# Altium project e80_doppler.PrjPcb
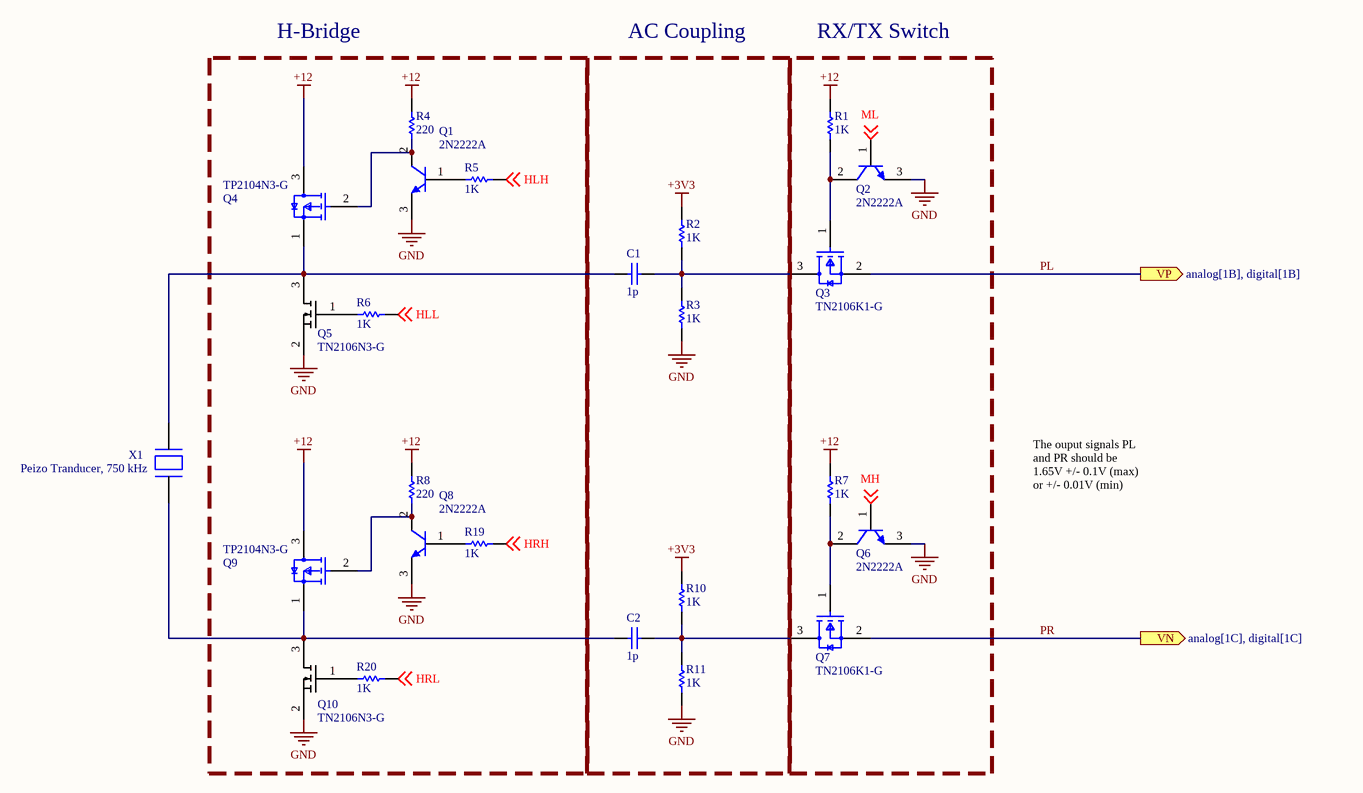
[diagram p0: interface.SchDoc]
4 sheets, 102 parts. Net scope: flat (ports and power ports of the same name join across sheets).
Sheets:
  interface.SchDoc
  analog.SchDoc
  digital.SchDoc
  simulation.SchDoc

## Sheet interface.SchDoc
size 381 x 241 mm; SheetNumber: 1; SheetTotal: 4

### Parts
C1  value 1p  (hidden comment: Capacitor)
C2  value 1p  (hidden comment: Capacitor)
Q1  2N2222A  [STM-TO-18-3]
Q2  2N2222A  [STM-TO-18-3]
Q3  TN2106K1-G  [FP-K1-T-IPC_A]
Q4  TP2104N3-G  [FP-TP2104N3-G-MFG]
Q5  TN2106N3-G
Q6  2N2222A  [STM-TO-18-3]
Q7  TN2106K1-G  [FP-K1-T-IPC_A]
Q8  2N2222A  [STM-TO-18-3]
Q9  TP2104N3-G  [FP-TP2104N3-G-MFG]
Q10  TN2106N3-G
R1  value 1K  (hidden comment: Resistor)
R2  value 1K  (hidden comment: Resistor)
R3  value 1K  (hidden comment: Resistor)
R4  value 220  (hidden comment: Resistor)
R5  value 1K  (hidden comment: Resistor)
R6  value 1K  (hidden comment: Resistor)
R7  value 1K  (hidden comment: Resistor)
R8  value 220  (hidden comment: Resistor)
R10  value 1K  (hidden comment: Resistor)
R11  value 1K  (hidden comment: Resistor)
R19  value 1K  (hidden comment: Resistor)
R20  value 1K  (hidden comment: Resistor)
X1  Peizo Tranducer, 750 kHz

### Blocks framed on the sheet
H-Bridge: Q1 Q4 Q5 Q8-Q10 R4-R6 R8 R19 R20
AC Coupling: C1 C2 R2 R3 R10 R11
RX/TX Switch: Q2 Q3 Q6 Q7 R1 R7

### Ports
VN (out, see analog[1C], digital[1C]), VP (out, see analog[1B], digital[1B])

### Nets
+3V3: R2.2 R10.2
+12: Q4.3(Drain) Q9.3(Drain) R1.2 R4.2 R7.2 R8.2
GND: Q1.3(E) Q2.3(E) Q5.2(S) Q6.3(E) Q8.3(E) Q10.2(S) R3.1 R11.1
HLH: R5.1 ; off-sheet HLH
HLL: R6.1 ; off-sheet HLL
HRH: R19.1 ; off-sheet HRH
HRL: R20.1 ; off-sheet HRL
MH: Q6.1(B) ; off-sheet MH
ML: Q2.1(B) ; off-sheet ML
PL: Q3.2(Source) ; port VP
PR: Q7.2(Source) ; port VN
NetC1_1: C1.1 Q4.1(Source) Q5.3(D) X1.1
NetC1_2: C1.2 Q3.3(Drain) R2.1 R3.2
NetC2_1: C2.1 Q9.1(Source) Q10.3(D) X1.2
NetC2_2: C2.2 Q7.3(Drain) R10.1 R11.2
NetQ1_1: Q1.1(B) R5.2
NetQ1_2: Q1.2(C) Q4.2(Gate) R4.1
NetQ2_2: Q2.2(C) Q3.1(Gate) R1.1
NetQ5_1: Q5.1(G) R6.2
NetQ6_2: Q6.2(C) Q7.1(Gate) R7.1
NetQ8_1: Q8.1(B) R19.2
NetQ8_2: Q8.2(C) Q9.2(Gate) R8.1
NetQ10_1: Q10.1(G) R20.2

### Notes on the sheet
- The ouput signals PL and PR should be 1.65V +/- 0.1V (max) or +/- 0.01V (min)

### Library data of the parts
C1 C2 = Capacitor: SimulationGenericComponent: True
Q1 Q2 Q6 Q8 = CMP-2000-05381-1: High Speed Switch, 0.6 A IC, -65 to 175 degC, 3-Pin TO-18, RoHS, Bulk; Manufacturer: STMicroelectronics; Power Dissipation Pd: 500mW; DC Current Gain hFE: 300hFE; Transistor Polarity: NPN; DC Collector Current: 600mA; No. of Pins: 3Pins; Transition Frequency ft: 300MHz; Collector Emitter Voltage V(br)ceo: 40V; Product Range: -; Package Reference: TO-18-3; Datasheet URL: https://datasheet.ciiva.com/25917/cd00003223-25917094.pdf; Automotive Qualification Standard: -; Transistor Case Style: TO-18; Operating Temperature Max: 175degC; Datasheet Version: Feb-03; Package Description: 3-Pin Through Hole Device, Dia 5.8 mm, Pitch 1.27 mm; Manufacturer URL: http://www.st.com/
Q3 Q7 = CMP-06369-000018-1: MOSFET N-CH 60V 280MA SOT23-3; Input Capacitance: 50pF; Turn-On Delay Time: 3ns; Number of Elements: 1; Power Dissipation: 360mW; Drain to Source Resistance: 2.5R; Fall Time: 5ns; Turn-Off Delay Time: 6ns; Gate to Source Voltage (Vgs): 20V; Polarity: N-CHANNEL; Element Configuration: Single; Min Operating Temperature: -55°C; Height: 0.95mm; Width: 1.3mm; Radiation Hardening: No; Mount: Surface Mount; Weight: 0.050717oz; Rds On Max: 2.5R; Packaging: Tape and Reel; Contact Plating: Tin; Package Quantity: 3000; Max Power Dissipation: 360mW; Number of Channels: 1; Drain to Source Breakdown Voltage: 60V; Max Operating Temperature: 150°C; Rise Time: 5ns; Case/Package: SOT-23; Continuous Drain Current (ID): 280mA; Number of Pins: 3; Series: -; Length: 2.9mm
Q4 Q9 = CMP-06369-000017-1: MOSFET P-CH 40V 175MA TO92-3; Turn-On Delay Time: 4ns; Drain to Source Resistance: 6R; Element Configuration: Single; Gate to Source Voltage (Vgs): 20V; Drain to Source Breakdown Voltage: -40V; Max Power Dissipation: 740mW; Number of Channels: 1; Input Capacitance: 60pF; Turn-Off Delay Time: 5ns; Polarity: P-CHANNEL; Max Operating Temperature: 150°C; Lead Free: Lead Free; Series: -; Mount: Through Hole; Number of Pins: 3; Min Operating Temperature: -55°C; Case/Package: TO-92-3; RoHS Compliant: Yes; Length: 5.21mm; Continuous Drain Current (ID): 175mA; Height: 5.33mm; Package Quantity: 1000; Drain to Source Voltage (Vdss): 40V; Rise Time: 4ns; Packaging: Bulk; Power Dissipation: 740mW; Fall Time: 4ns; Weight: 0.016oz; Width: 4.19mm; Rds On Max: 6R
Q5 Q10 = TN2106N3-G: Small Signal Field-Effect Transistor, 1.2A I(D), 100V, 1-Element, N-Channel, Silicon, Metal-oxide Semiconductor FET, TO-92; Manufacturer: Microchip Supertex; Package Body Material: Plastic; Drain Current-Max (Abs) (ID): 300mA; Drain-source On Resistance-Max: 2.5R; DS Breakdown Voltage-Min: 60V; Feedback Cap-Max (Crss): 8pF; Number of Elements: 1; Operating Mode: ENHANCEMENT MODE; Power Dissipation-Max (Abs): 740mW; Surface Mount: No; Transistor Application: SWITCHING; Qualification Status: Not Qualified; Supplier: Digikey; Supplier Part Number: TN2106N3-G-ND; Manufacturer Part Number: TN2106N3-G; RoHS: Yes; Category: MOSFETs; Stock: 1423; Pricing: 1=0.68, 25=0.56, 100=0.52 (USD); Pins: 3; Package Shape: Round; Terminal Finish: Tin; Transistor Element Material: SILICON; Max Operating Temperature: 150°C; JESD-609 Code: e3; Polarity/Channel Type: N-CHANNEL; Drain Current-Max (ID): 300mA; FET Technology: METAL-OXIDE SEMICONDUCTOR; JESD-30 Code: O-PBCY-T3; Package Style: CYLINDRICALMeter; Terminal Form: Through Hole; Terminal Position: BOTTOM; JEDEC-95 Code: TO-92; Reach SVHC Compliant: Yes; RoHS Compliant: Yes; ComponentLink1URL: https://datasheet.ciiva.com:443/pdfs/VipMasterIC/IC/SUPR/SUPRS03953/SUPRS03953-1.pdf?src-supplier=IHS+Markit; ComponentLink1Description: https://datasheet.ciiva.com:443/pdfs/VipMasterIC/IC/SUPR/SUPRS03953/SUPRS03953-1.pdf?src-supplier=IHS+Markit; ComponentLink2URL: https://datasheet.ciiva.com/16232/tn2106-16232278.pdf?src-supplier=Onlinecomponents.com; ComponentLink2Description: https://datasheet.ciiva.com/16232/tn2106-16232278.pdf?src-supplier=Onlinecomponents.com; ComponentLink3URL: https://datasheet.ciiva.com/30180/14tn2106-30180231.pdf?src-supplier=Onlinecomponents.com; ComponentLink3Description: https://datasheet.ciiva.com/30180/14tn2106-30180231.pdf?src-supplier=Onlinecomponents.com
R1-R8 R10 R11 R19 R20 = Resistor: TC1: 0; SimulationGenericComponent: True; TC2: 0
X1 = SMD20T27F750S

## Sheet analog.SchDoc
size A1; SheetNumber: 2; SheetTotal: 4
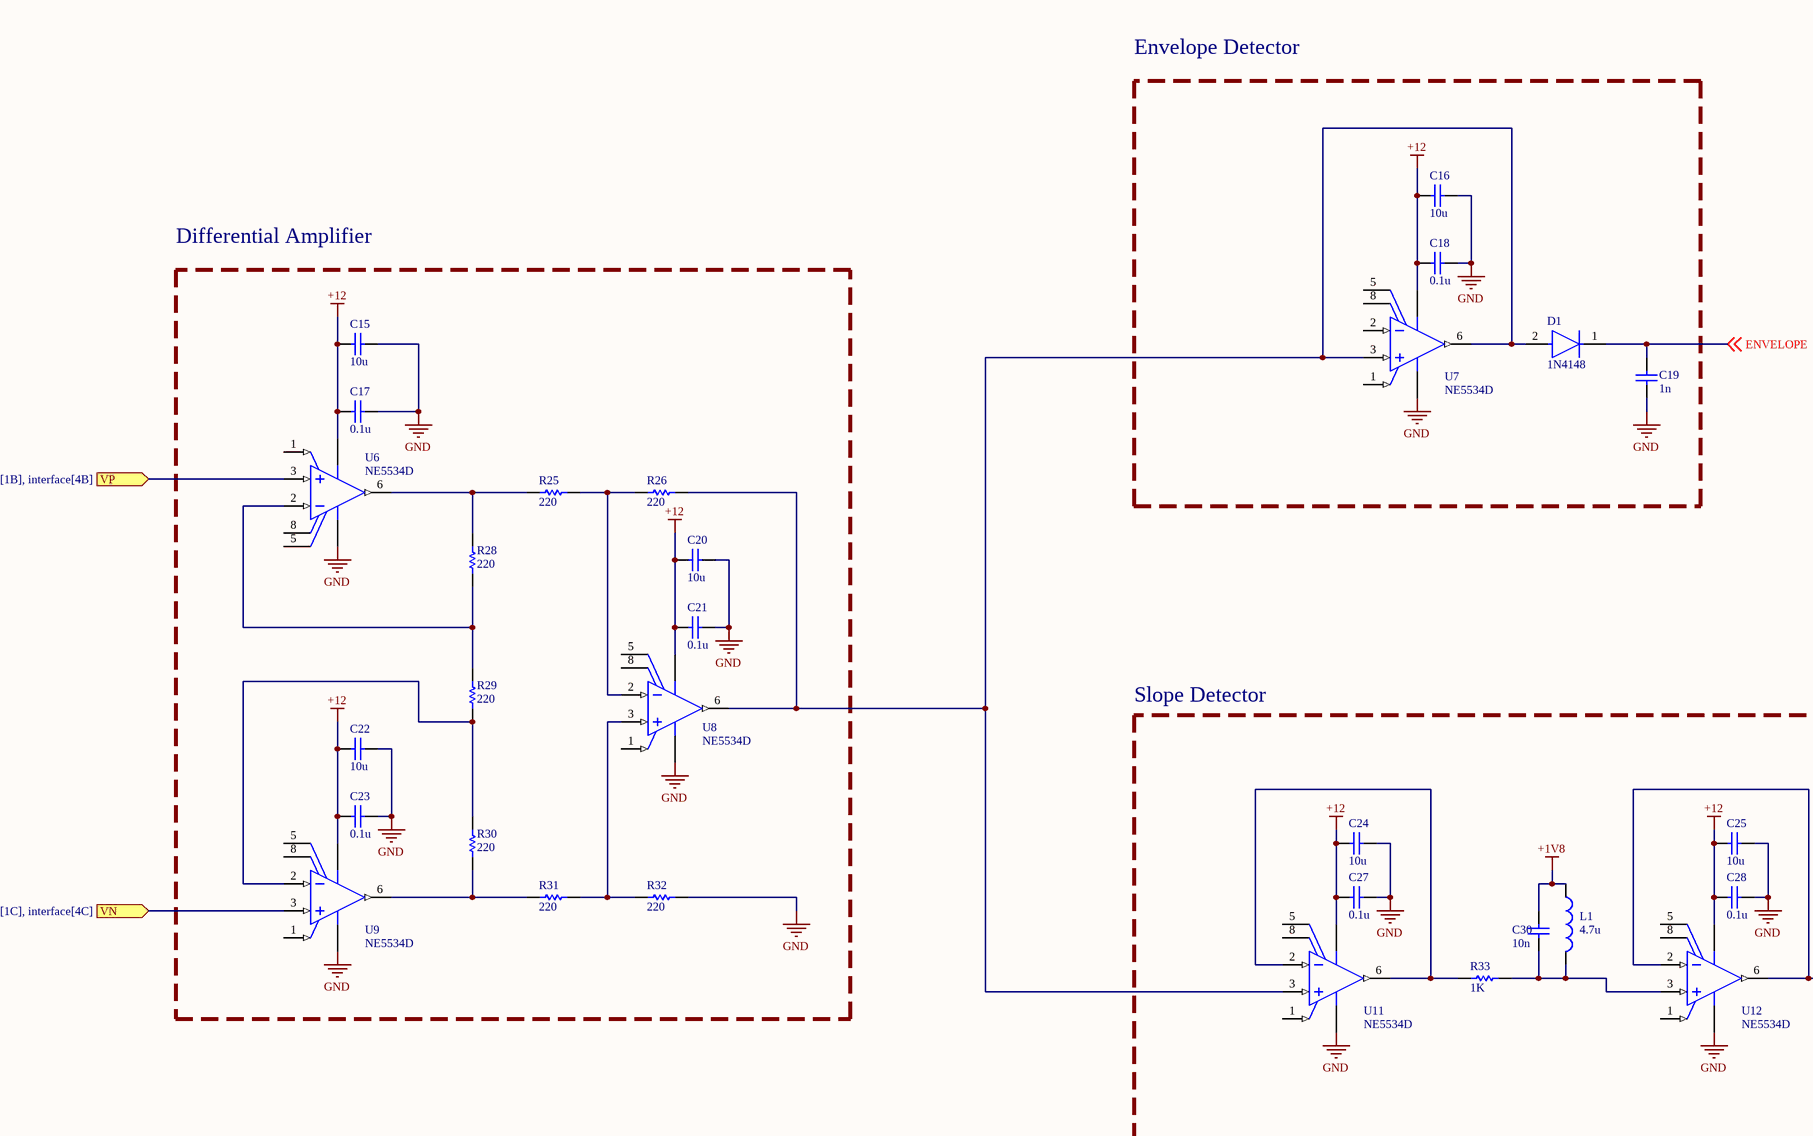
[diagram p1: analog.SchDoc, left]
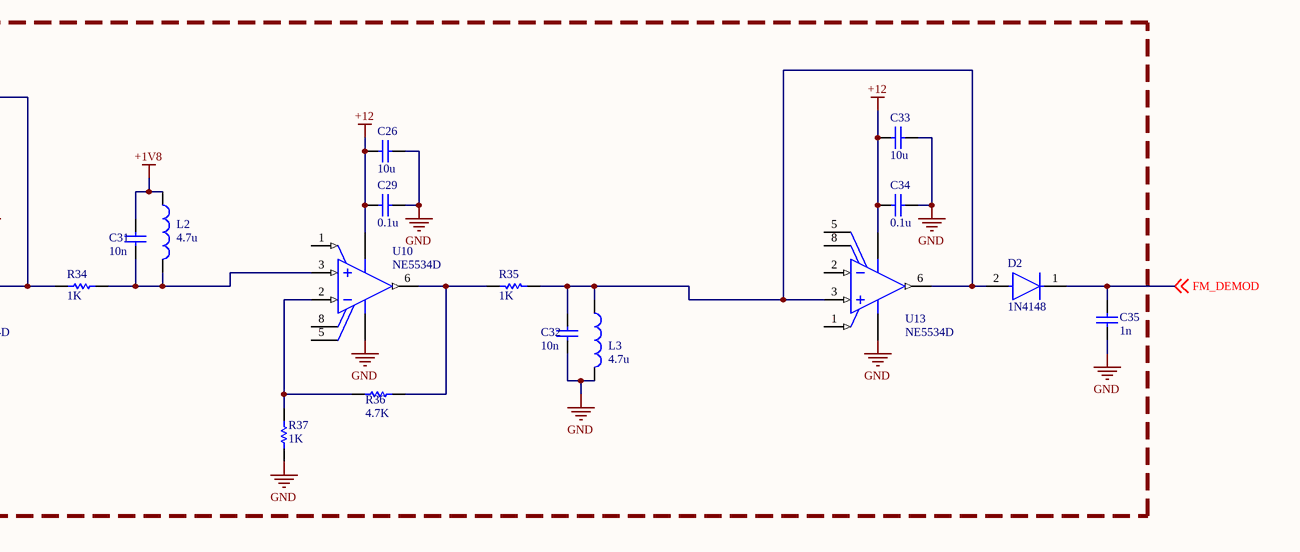
[diagram p2: analog.SchDoc, right]

### Parts
C15  value 10u  (hidden comment: Capacitor)
C16  value 10u  (hidden comment: Capacitor)
C17  value 0.1u  (hidden comment: Capacitor)
C18  value 0.1u  (hidden comment: Capacitor)
C19  value 1n  (hidden comment: Capacitor)
C20  value 10u  (hidden comment: Capacitor)
C21  value 0.1u  (hidden comment: Capacitor)
C22  value 10u  (hidden comment: Capacitor)
C23  value 0.1u  (hidden comment: Capacitor)
C24  value 10u  (hidden comment: Capacitor)
C25  value 10u  (hidden comment: Capacitor)
C26  value 10u  (hidden comment: Capacitor)
C27  value 0.1u  (hidden comment: Capacitor)
C28  value 0.1u  (hidden comment: Capacitor)
C29  value 0.1u  (hidden comment: Capacitor)
C30  value 10n  (hidden comment: Capacitor)
C31  value 10n  (hidden comment: Capacitor)
C32  value 10n  (hidden comment: Capacitor)
C33  value 10u  (hidden comment: Capacitor)
C34  value 0.1u  (hidden comment: Capacitor)
C35  value 1n  (hidden comment: Capacitor)
D1  1N4148  [FP-017AG-MFG]
D2  1N4148  [FP-017AG-MFG]
L1  value 4.7u  (hidden comment: Inductor)
L2  value 4.7u  (hidden comment: Inductor)
L3  value 4.7u  (hidden comment: Inductor)
R25  value 220  (hidden comment: Resistor)
R26  value 220  (hidden comment: Resistor)
R28  value 220  (hidden comment: Resistor)
R29  value 220  (hidden comment: Resistor)
R30  value 220  (hidden comment: Resistor)
R31  value 220  (hidden comment: Resistor)
R32  value 220  (hidden comment: Resistor)
R33  value 1K  (hidden comment: Resistor)
R34  value 1K  (hidden comment: Resistor)
R35  value 1K  (hidden comment: Resistor)
R36  value 4.7K  (hidden comment: Resistor)
R37  value 1K  (hidden comment: Resistor)
U6  NE5534D  [D0008A_N]
U7  NE5534D  [D0008A_N]
U8  NE5534D  [D0008A_N]
U9  NE5534D  [D0008A_N]
U10  NE5534D  [D0008A_N]
U11  NE5534D  [D0008A_N]
U12  NE5534D  [D0008A_N]
U13  NE5534D  [D0008A_N]

### Blocks framed on the sheet
Slope Detector: C24-C35 D2 L1-L3 R33-R37 U10-U13

### Ports
VN (in, see digital[1C], interface[4C]), VP (in, see digital[1B], interface[4B])

### Nets
+1V8: C30.2 C31.2 L1.1 L2.1
+12: C15.1 C16.1 C17.1 C18.1 C20.1 C21.1 C22.1 C23.1 C24.1 C25.1 C26.1 C27.1 C28.1 C29.1 C33.1 C34.1 U6.4(VCC-) U7.7(VCC+) U8.7(VCC+) U9.7(VCC+) U10.4(VCC-) U11.7(VCC+) U12.7(VCC+) U13.7(VCC+)
GND: C15.2 C16.2 C17.2 C18.2 C19.1 C20.2 C21.2 C22.2 C23.2 C24.2 C25.2 C26.2 C27.2 C28.2 C29.2 C32.2 C33.2 C34.2 C35.1 L3.1 R32.1 R37.2 U6.7(VCC+) U7.4(VCC-) U8.4(VCC-) U9.4(VCC-) U10.7(VCC+) U11.4(VCC-) U12.4(VCC-) U13.4(VCC-)
ENVELOPE: C19.2 D1.1(C) ; off-sheet ENVELOPE
FM_DEMOD: C35.2 D2.1(C) ; off-sheet FM_DEMOD
PL: U6.3(IN+) ; port VP
PR: U9.3(IN+) ; port VN
NetC30_1: C30.1 L1.2 R33.1 U12.3(IN+)
NetC31_1: C31.1 L2.2 R34.1 U10.3(IN+)
NetC32_1: C32.1 D2.2(A) L3.2 R35.1 U13.3(IN+) U13.6(OUT)
NetD1_2: D1.2(A) R26.1 U7.3(IN+) U7.6(OUT) U8.6(OUT) U11.3(IN+)
NetR25_1: R25.1 R26.2 U8.2(IN-)
NetR25_2: R25.2 R28.2 U6.6(OUT)
NetR28_1: R28.1 R29.2 U6.2(IN-)
NetR29_1: R29.1 R30.2 U9.2(IN-)
NetR30_1: R30.1 R31.2 U9.6(OUT)
NetR31_1: R31.1 R32.2 U8.3(IN+)
NetR33_2: R33.2 U11.2(IN-) U11.6(OUT)
NetR34_2: R34.2 U12.2(IN-) U12.6(OUT)
NetR35_2: R35.2 R36.1 U10.6(OUT)
NetR36_2: R36.2 R37.1 U10.2(IN-)

Not connected (* = marked no-connect by the designer): U6 1(BALANCE) 5(COMP) 8(COMP/BAL); U7 1(BALANCE) 2(IN-) 5(COMP) 8(COMP/BAL); U8 1(BALANCE) 5(COMP) 8(COMP/BAL); U9 1(BALANCE) 5(COMP) 8(COMP/BAL); U10 1(BALANCE) 5(COMP) 8(COMP/BAL); U11 1(BALANCE) 5(COMP) 8(COMP/BAL); U12 1(BALANCE) 5(COMP) 8(COMP/BAL); U13 1(BALANCE) 2(IN-) 5(COMP) 8(COMP/BAL)

### Notes on the sheet
- Envelope Detector
- Differential Amplifier

### Library data of the parts
C15-C35 = Capacitor: SimulationGenericComponent: True
D1 D2 = CMP-07163-000046-1: DIODE GEN PURP 100V 200MA DO35; Forward Voltage: 1V; Max Power Dissipation: 500mW; Max Reverse Current: 5uA; Forward Current: 300mA; Current: 4A; Reverse Recovery Time: 4ns; Element Configuration: Single; Outside Diameter: 1.85mm; Capacitance: 4pF; Polarity: Standard; Max Forward Surge Current (Ifsm): 1A; Reverse Voltage: 100V; Output Current: 200mA; Average Rectified Current: 200mA; Diameter: 1.91mm; Max Repetitive Reverse Voltage (Vrrm): 100V; Current Rating: 200mA; Case/Package: DO-35; Lead Free: Lead Free; Number of Pins: 2; Recovery Time: 4ns; Packaging: Bulk; Contact Plating: Tin; Voltage: 100V; Mount: Through Hole; Max Surge Current: 4A; Package Quantity: 2000; Width: 1.91mm; Max Reverse Voltage (DC): 100V; Length: 4.56mm; Radiation Hardening: No; Power Dissipation: 500mW; Voltage Rating (DC): 100V; Peak Non-Repetitive Surge Current: 4A; REACH SVHC: No SVHC; Height: 4.56mm; Max Operating Temperature: 175°C; Series: -; Weight: 0.01lb; Min Operating Temperature: -65°C
L1-L3 = Inductor: SimulationGenericComponent: True
R25 R26 R28-R37 = Resistor: TC1: 0; SimulationGenericComponent: True; TC2: 0
U6-U13 = CMP-0017-00431-2: Low-Noise High-Speed Audio Operational Amplifier, 10 to 30 V, 0 to 70 degC, 8-pin SOIC (D8), Green (RoHS & no Sb/Br); Manufacturer: Texas Instruments; Sub Family: General Purpose Amplifier, High Supply Voltage Amplifier (>=30V), Low Noise Amp (<=10nV/rtHz); Total Supply Voltage(Max)(+5V is 5, +/-5V is 10): 30; CMRR(Min)(dB): 70; Number of Channels: 1; IIB(Max)(pA): 1500000; Vio (25C)(Max)(mV): 4; Total Supply Voltage(Min)(+5V is 5, +/-5V is 10): 10; Iq per channel(Max)(mA): 8; Slew Rate(Typ)(V/us): 13; PackageVersion: 4040047-3/M, 06/2011; Mounting Technology: Surface Mount; DatasheetVersion: SLOS070C; ComponentLink1URL: http://www.ti.com/; ComponentLink3Description: Package Specification; Eco-Plan: Green (RoHS & no Sb/Br); ComponentLink3URL: http://www.ti.com/litv/pdf/msoi002j; ComponentLink2URL: http://www.ti.com/lit/ds/symlink/ne5534.pdf; Code_JEDEC: MS-012; PartNumber: NE5534D; ComponentLink2Description: Datasheet; GBW(Typ)(MHz): 10; PackageDescription: 8-Pin Plastic Small Outline, Body 4.9 x 3.9 mm, Pitch 1.27 mm; PackageReference: D0008A; Vn at 1kHz(Typ)(nV/rtHz): 4; ComponentLink1Description: Manufacturer URL

## Sheet digital.SchDoc
size B; SheetNumber: 2; SheetTotal: 3
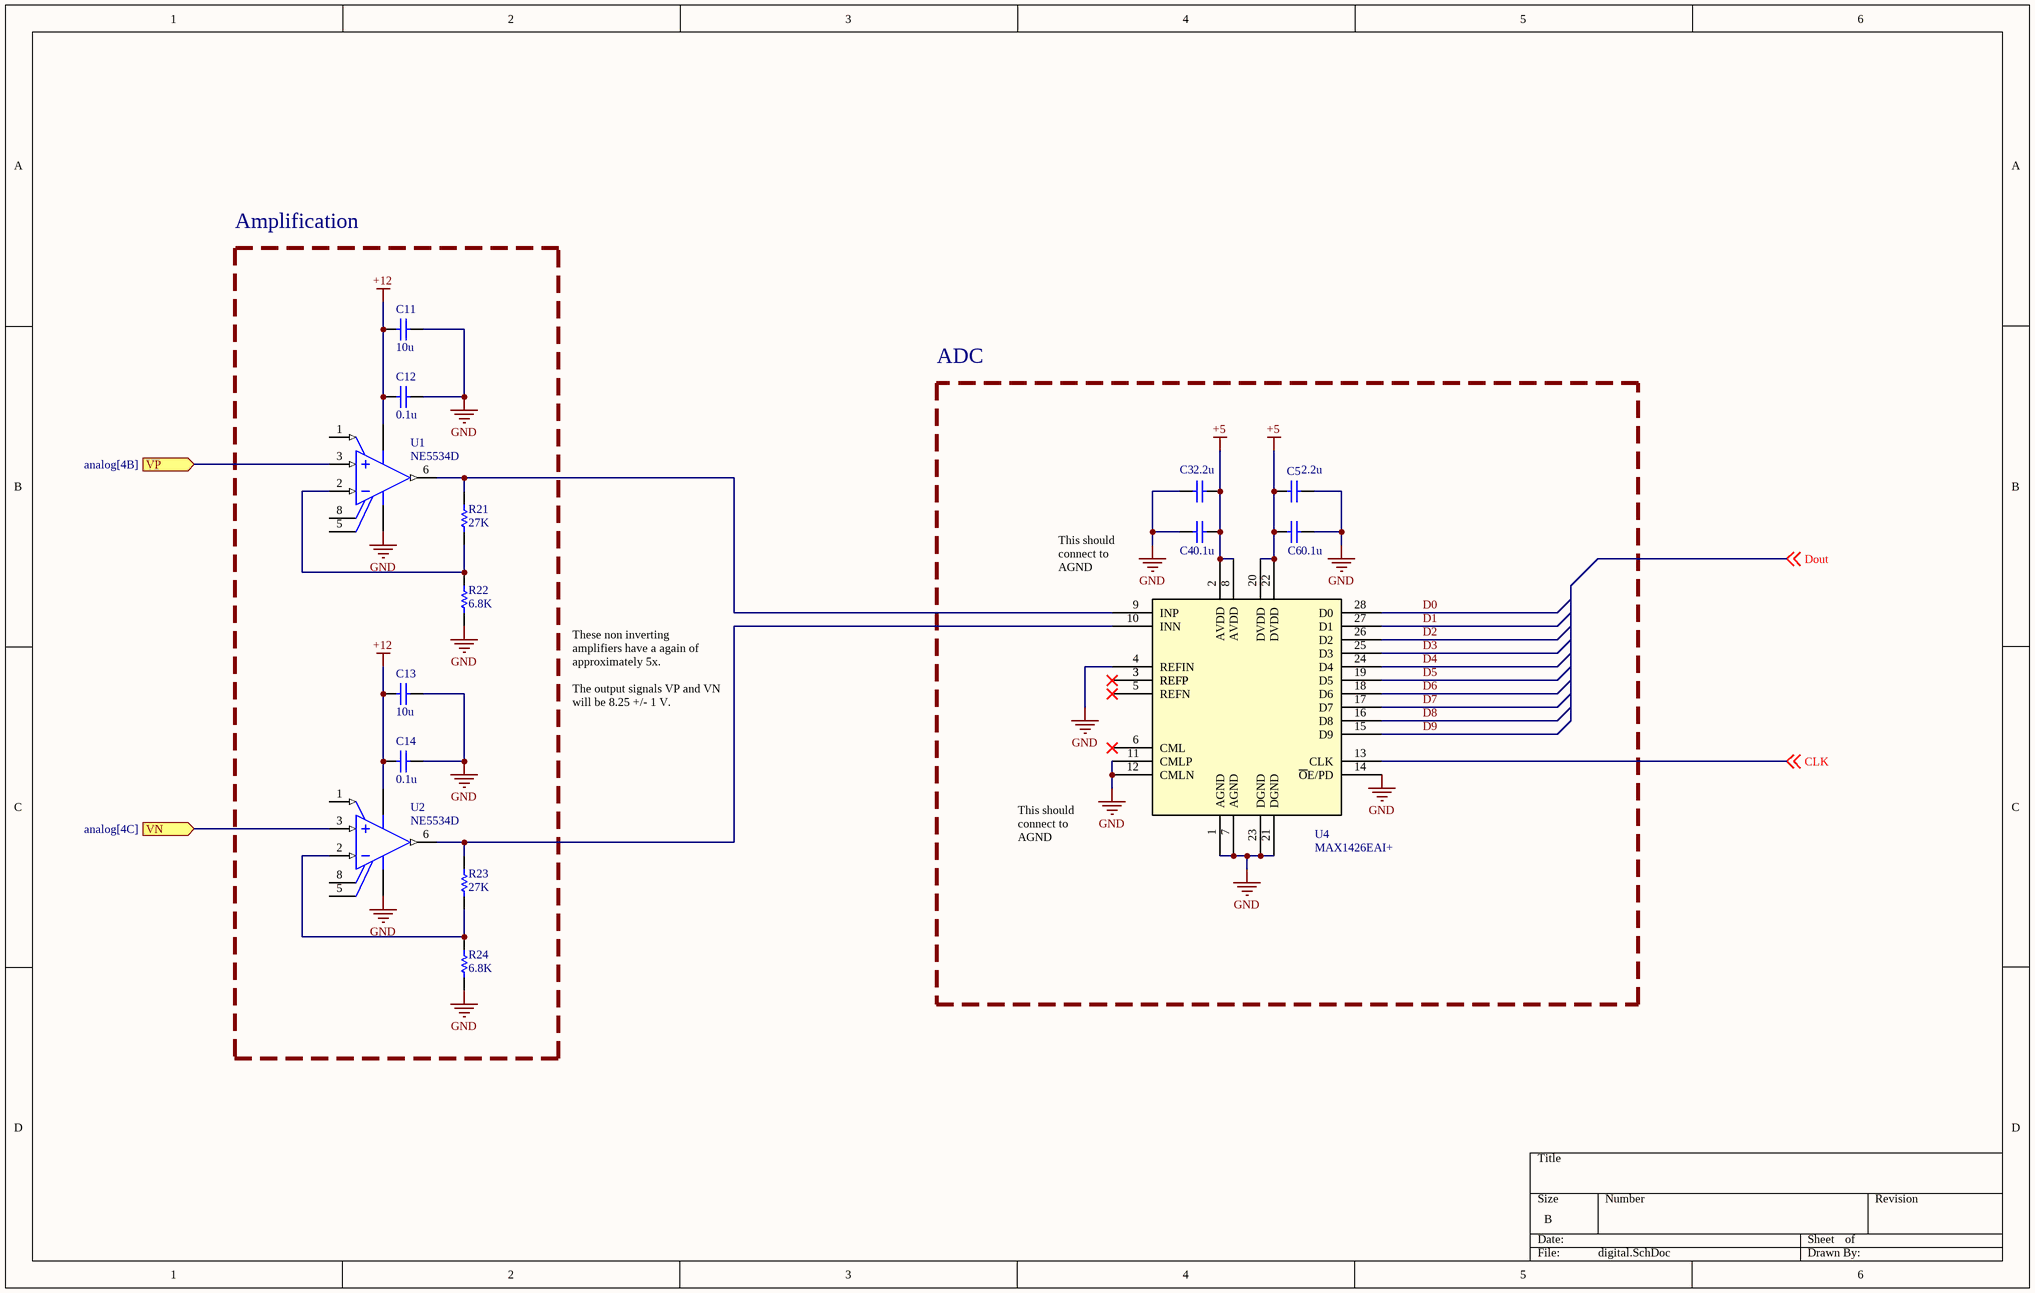
[diagram p3: digital.SchDoc]

### Parts
C3  value 2.2u  (hidden comment: Capacitor)
C4  value 0.1u  (hidden comment: Capacitor)
C5  value 2.2u  (hidden comment: Capacitor)
C6  value 0.1u  (hidden comment: Capacitor)
C11  value 10u  (hidden comment: Capacitor)
C12  value 0.1u  (hidden comment: Capacitor)
C13  value 10u  (hidden comment: Capacitor)
C14  value 0.1u  (hidden comment: Capacitor)
R21  value 27K  (hidden comment: Resistor)
R22  value 6.8K  (hidden comment: Resistor)
R23  value 27K  (hidden comment: Resistor)
R24  value 6.8K  (hidden comment: Resistor)
U1  NE5534D  [D0008A_N]
U2  NE5534D  [D0008A_N]
U4  MAX1426EAI+  [21-0056C_28_MXM]

### Blocks framed on the sheet
Amplification: C11-C14 R21-R24 U1 U2
ADC: C3-C6 U4

### Ports
VN (in, see analog[4C]), VP (in, see analog[4B])

### Nets
+5: C3.2 C4.2 C5.2 C6.2 U4.2(AVDD) U4.8(AVDD) U4.20(DVDD) U4.22(DVDD)
+12: C11.1 C12.1 C13.1 C14.1 U1.4(VCC-) U2.4(VCC-)
GND: C3.1 C4.1 C5.1 C6.1 C11.2 C12.2 C13.2 C14.2 R22.1 R24.1 U1.7(VCC+) U2.7(VCC+) U4.1(AGND) U4.4(REFIN) U4.7(AGND) U4.11(CMLP) U4.12(CMLN) U4.14(~{O}E/PD) U4.21(DGND) U4.23(DGND)
CLK: U4.13(CLK) ; off-sheet CLK
D0: U4.28(D0)
D1: U4.27(D1)
D2: U4.26(D2)
D3: U4.25(D3)
D4: U4.24(D4)
D5: U4.19(D5)
D6: U4.18(D6)
D7: U4.17(D7)
D8: U4.16(D8)
D9: U4.15(D9)
PL: U1.3(IN+) ; port VP
PR: U2.3(IN+) ; port VN
NetR21_1: R21.1 R22.2 U1.2(IN-)
NetR21_2: R21.2 U1.6(OUT) U4.9(INP)
NetR23_1: R23.1 R24.2 U2.2(IN-)
NetR23_2: R23.2 U2.6(OUT) U4.10(INN)

Not connected (* = marked no-connect by the designer): U1 1(BALANCE) 5(COMP) 8(COMP/BAL); U2 1(BALANCE) 5(COMP) 8(COMP/BAL); U4 3(REFP)* 5(REFN)* 6(CML)*

### Notes on the sheet
- (near U4) This should connect to AGND
- These non inverting amplifiers have a again of approximately 5x.
  The output signals VP and VN will be 8.25 +/- 1 V.
- This should connect to AGND
- Labels drawn without touching a wire or pin: Dout

### Library data of the parts
C3-C6 C11-C14 = Capacitor: SimulationGenericComponent: True
R21-R24 = Resistor: TC1: 0; SimulationGenericComponent: True; TC2: 0
U1 U2 = CMP-0017-00431-2: as U6 on sheet analog; PackageVersion: 4040047-3/M, 06/2011; Mounting Technology: Surface Mount; DatasheetVersion: SLOS070C; ComponentLink1URL: http://www.ti.com/; ComponentLink3Description: Package Specification; Eco-Plan: Green (RoHS & no Sb/Br); ComponentLink3URL: http://www.ti.com/litv/pdf/msoi002j; ComponentLink2URL: http://www.ti.com/lit/ds/symlink/ne5534.pdf; Code_JEDEC: MS-012; PartNumber: NE5534D; ComponentLink2Description: Datasheet; GBW(Typ)(MHz): 10; PackageDescription: 8-Pin Plastic Small Outline, Body 4.9 x 3.9 mm, Pitch 1.27 mm; PackageReference: D0008A; Vn at 1kHz(Typ)(nV/rtHz): 4; ComponentLink1Description: Manufacturer URL
U4 = MAX1426EAI+: No Description Available; Mfr_Name: Analog Devices / Maxim Integrated; RefDes: RefDes; Type: Type

## Sheet simulation.SchDoc
size A; SheetNumber: 3; SheetTotal: 3
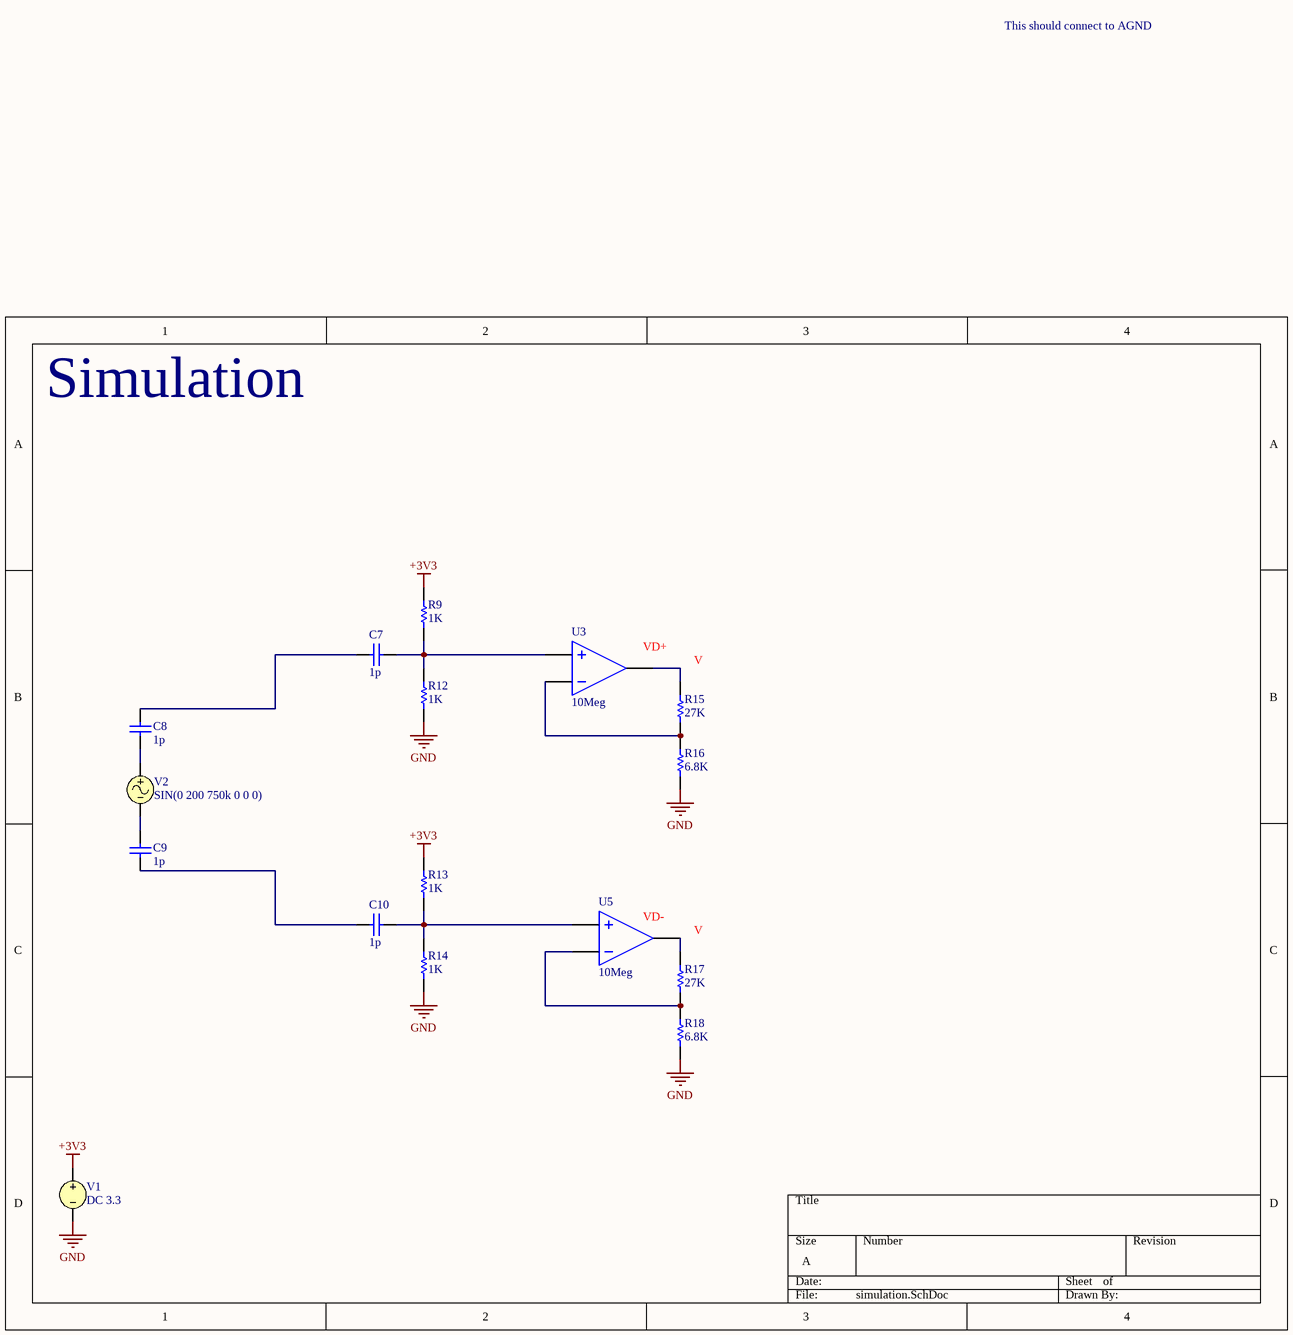
[diagram p4: simulation.SchDoc]

### Parts
C7  value 1p  (hidden comment: Capacitor)
C8  value 1p  (hidden comment: Capacitor)
C9  value 1p  (hidden comment: Capacitor)
C10  value 1p  (hidden comment: Capacitor)
R9  value 1K  (hidden comment: Resistor)
R12  value 1K  (hidden comment: Resistor)
R13  value 1K  (hidden comment: Resistor)
R14  value 1K  (hidden comment: Resistor)
R15  value 27K  (hidden comment: Resistor)
R16  value 6.8K  (hidden comment: Resistor)
R17  value 27K  (hidden comment: Resistor)
R18  value 6.8K  (hidden comment: Resistor)
U3  GAIN: 10Meg  (hidden comment: Ideal Operational Amplifier)
U5  GAIN: 10Meg  (hidden comment: Ideal Operational Amplifier)
V1  DC 3.3
V2  SIN(0 200 750k 0 0 0)

### Nets
+3V3: R9.2 R13.2 V1.1
GND: R12.1 R14.1 R16.1 R18.1 V1.2
NetC7_1: C7.1 C8.2
NetC7_2: C7.2 R9.1 R12.2 U3.2(IN+)
NetC8_1: C8.1 V2.1
NetC9_1: C9.1 C10.1
NetC9_2: C9.2 V2.2
NetC10_2: C10.2 R13.1 R14.2 U5.2(IN+)
NetR15_1: R15.1 R16.2 U3.1(IN-)
NetR15_2: R15.2 U3.3(OUT)
NetR17_1: R17.1 R18.2 U5.1(IN-)
NetR17_2: R17.2 U5.3(OUT)

### Notes on the sheet
- This should connect to AGND
- Simulation

### Library data of the parts
C7-C10 = Capacitor: SimulationGenericComponent: True
R9 R12-R18 = Resistor: TC1: 0; SimulationGenericComponent: True; TC2: 0
U3 U5 = OpAmp: SimulationGenericComponent: True
V1 = VSRC: Voltage Source; Note: PCB Footprint - Not required; AC Magnitude: 1; AC Phase: 0; Value: 3.3; Published: 8-Jun-2000; LatestRevisionDate: 17-Jul-2002; LatestRevisionNote: Re-released for DXP Platform.; PackageReference: Not Applicable; Publisher: Altium Limited
V2 = VSIN: Sinusoidal Voltage Source; Note: PCB Footprint - Not required; Offset: 0; Amplitude: 200; AC Magnitude: 1; Published: 8-Jun-2000; LatestRevisionDate: 15-Nov-2004; LatestRevisionNote: Corrected Netlist.; PackageReference: Not Applicable; Publisher: Altium Limited; Frequency: 750k; Delay: 0; Damping Factor: 0; Phase: 0; DC Magnitude: 0; AC Phase: 0

## Nets that join several sheets
+3V3: interface (R2.2 R10.2), simulation (R9.2 R13.2 V1.1)
+12: interface (6 pins), analog (24 pins), digital (6 pins)
GND: interface (8 pins), analog (30 pins), digital (20 pins), simulation (5 pins)
PL: interface (Q3.2), analog (U6.3), digital (U1.3)
PR: interface (Q7.2), analog (U9.3), digital (U2.3)